# Altium schematic sheet 喷雾系统ESP32 S3.SchDoc
size A1
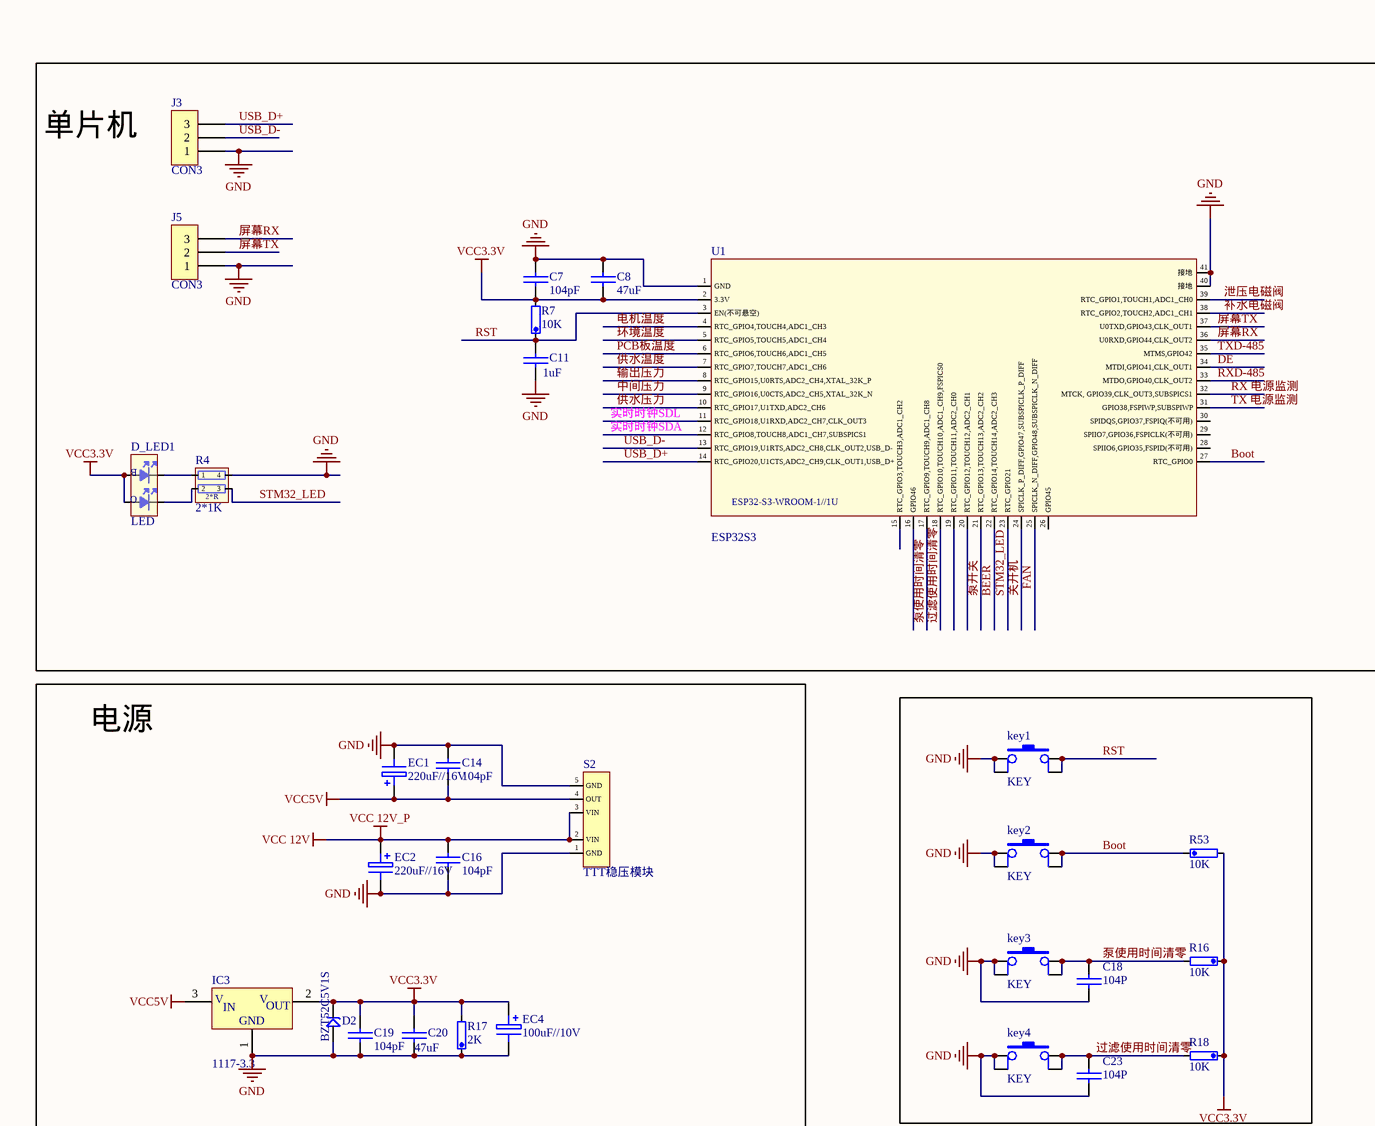
[diagram p0: 喷雾系统ESP32 S3.SchDoc, top left]
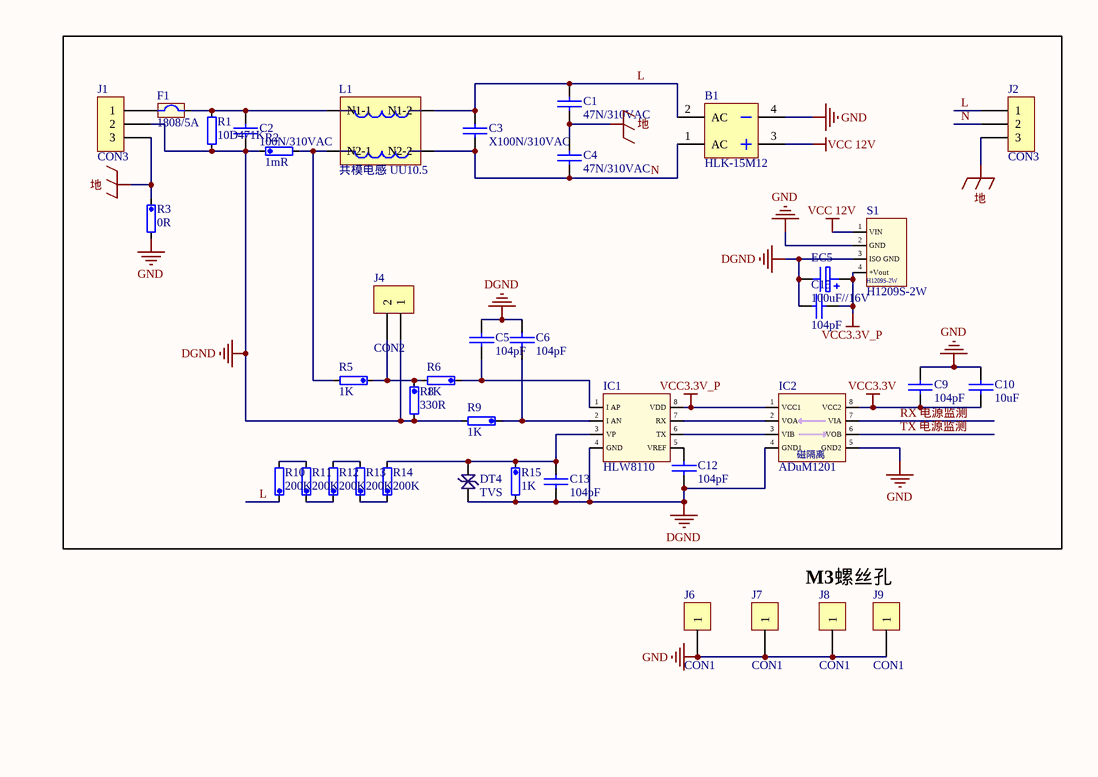
[diagram p1: 喷雾系统ESP32 S3.SchDoc, top right]
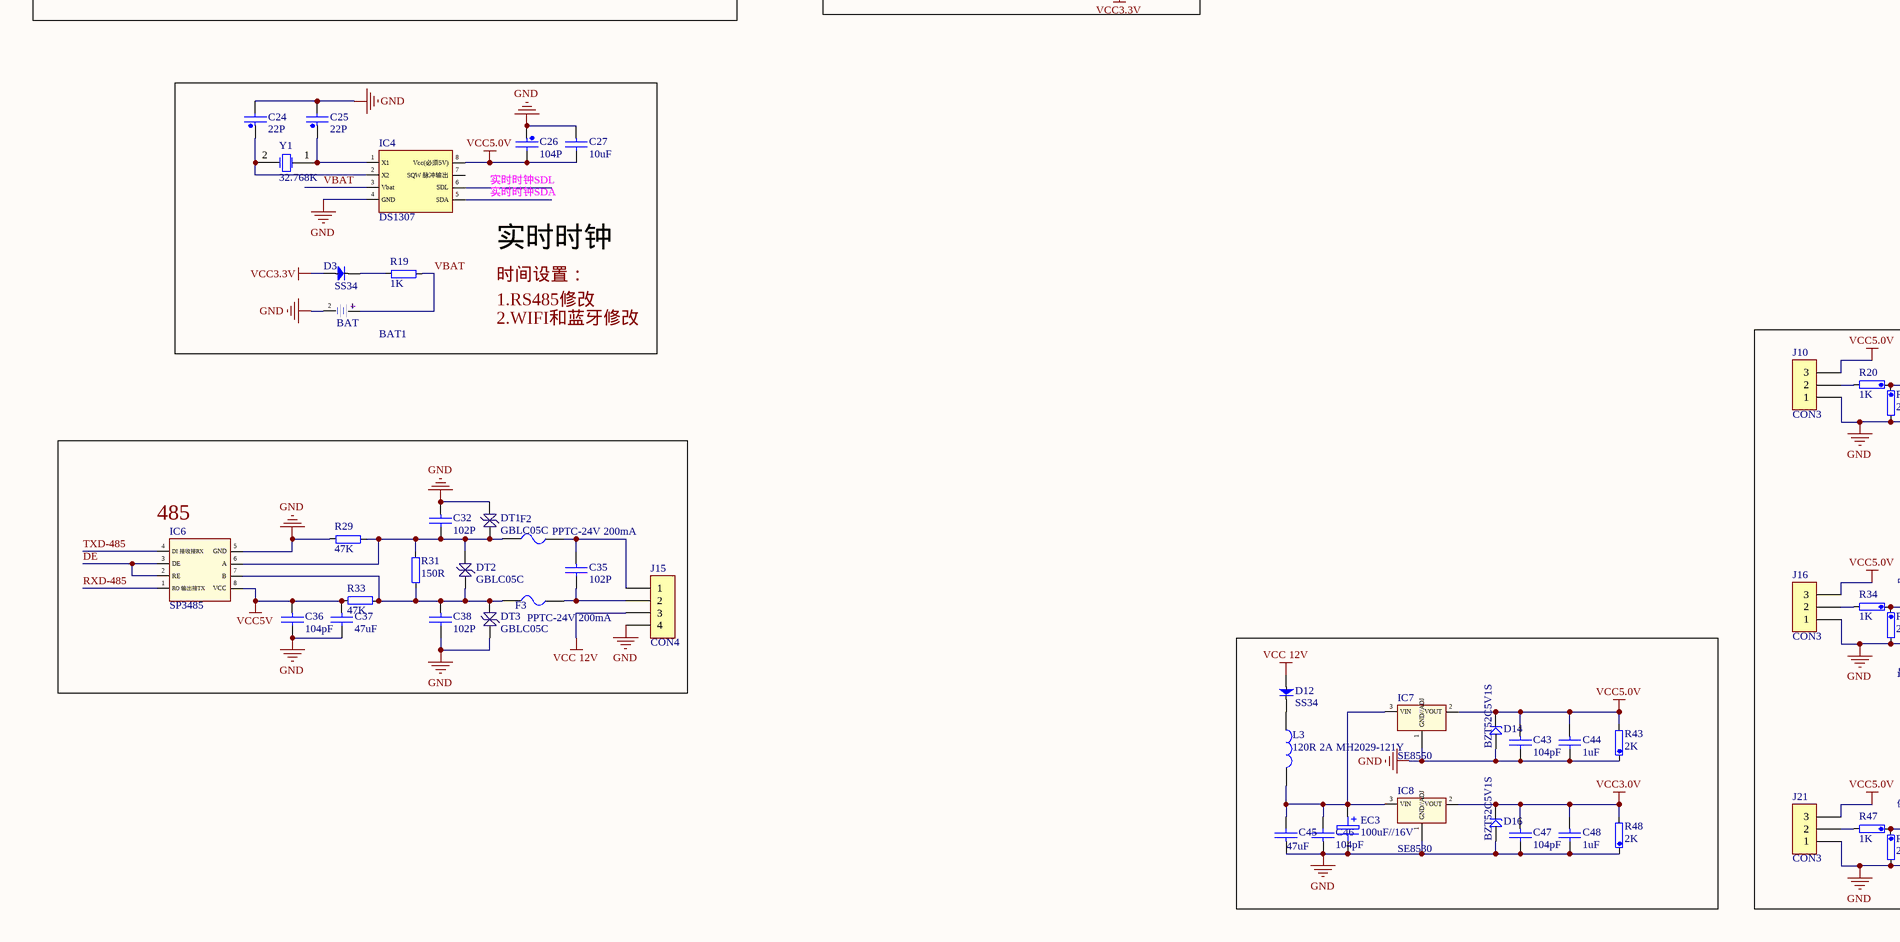
[diagram p2: 喷雾系统ESP32 S3.SchDoc, bottom left]
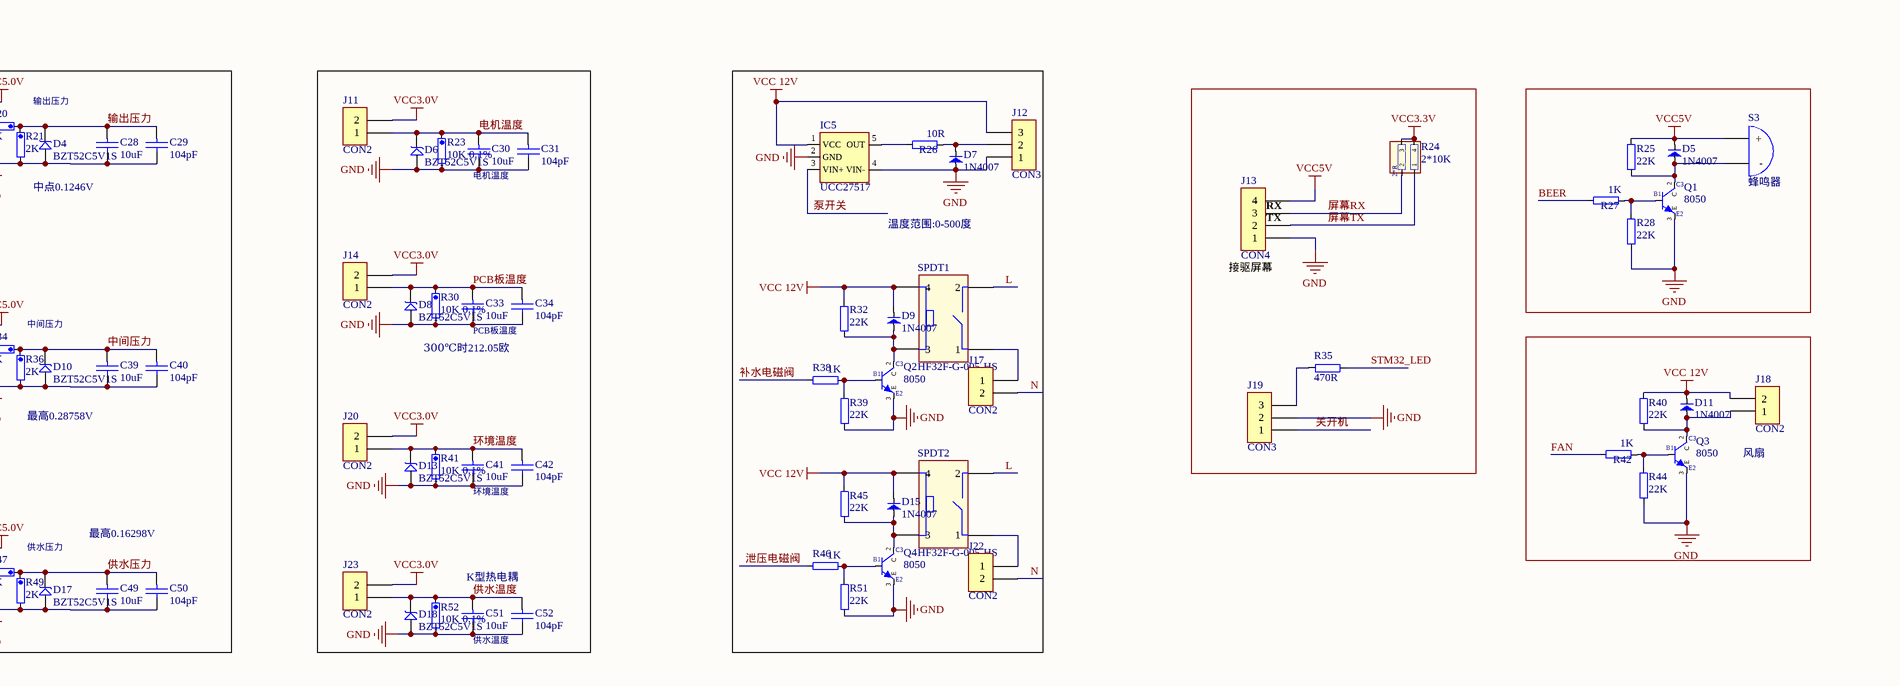
[diagram p3: 喷雾系统ESP32 S3.SchDoc, bottom right]

## Parts
B1  HLK-15M12  [电源模块15W AC转DC HI-link]
BAT1  BAT  [直插锂电池]
C1  47N/310VAC  [安规Y电容]
C2  100N/310VAC  [安规X电容]
C3  X100N/310VAC  [安规X电容]
C4  47N/310VAC  [安规Y电容]
C5  104pF  [B0805]
C6  104pF  [B0805]
C7  104pF  [B0805]
C8  47uF  [B0805]
C9  104pF  [B0805]
C10  10uF  [B0805]
C11  1uF  [B0805]
C12  104pF  [B0805]
C13  104pF  [B0805]
C14  104pF  [B0805]
C15  104pF  [B0805]
C16  104pF  [B0805]
C18  104P  [B0805]
C19  104pF  [B0805]
C20  47uF  [B0805]
C23  104P  [B0805]
C24  22P  [B0603]
C25  22P  [B0603]
C26  104P  [B0805]
C27  10uF  [B0805]
C28  10uF  [B0805]
C29  104pF  [B0805]
C30  10uF  [B0805]
C31  104pF  [B0805]
C32  102P  [B0805]
C33  10uF  [B0805]
C34  104pF  [B0805]
C35  102P  [B0805]
C36  104pF  [B0805]
C37  47uF  [B0805]
C38  102P  [B0805]
C39  10uF  [B0805]
C40  104pF  [B0805]
C41  10uF  [B0805]
C42  104pF  [B0805]
C43  104pF  [B0805]
C44  1uF  [B0805]
C45  47uF  [B0805]
C46  104pF  [B0805]
C47  104pF  [B0805]
C48  1uF  [B0805]
C49  10uF  [B0805]
C50  104pF  [B0805]
C51  10uF  [B0805]
C52  104pF  [B0805]
D2  BZT52C5V1S  [SOD-323]
D3  SS34  [SOD-323]
D4  BZT52C5V1S  [SOD-323]
D5  1N4007  [SOD-323]
D6  BZT52C5V1S  [SOD-323]
D7  1N4007  [SOD-323]
D8  BZT52C5V1S  [SOD-323]
D9  1N4007  [SOD-323]
D10  BZT52C5V1S  [SOD-323]
D11  1N4007  [SOD-323]
D12  SS34  [SOD-323]
D13  BZT52C5V1S  [SOD-323]
D14  BZT52C5V1S  [SOD-323]
D15  1N4007  [SOD-323]
D16  BZT52C5V1S  [SOD-323]
D17  BZT52C5V1S  [SOD-323]
D18  BZT52C5V1S  [SOD-323]
D_LED1  LED  [双色LED 1615]
DT1  GBLC05C  [SOD-323-12]
DT2  GBLC05C  [SOD-323-12]
DT3  GBLC05C  [SOD-323-12]
DT4  TVS  [SOD-323]
EC1  220uF//16V  [贴片电容6.3*5.4]
EC2  220uF//16V  [贴片电容6.3*5.4]
EC3  100uF//16V  [C型 电容]
EC4  100uF//10V  [C型 电容]
EC5  100uF//16V  [C型 电容]
F1  1808/5A  [1808贴片保险]
F2  PPTC-24V 200mA  [FU 0805]
F3  PPTC-24V 200mA  [FU 0805]
IC1  HLW8110  [SOP8]
IC2  ADuM1201  [SOP8]
IC3  1117-3.3  [SOT-223]
IC4  DS1307  [SOP8]
IC5  UCC27517  [SOT23-5]
IC6  SP3485  [SOP8]
IC7  SE8550  [SOT_89]
IC8  SE8530  [SOT23_231]
J1  CON3  [CON3_5.08 弯]
J2  CON3  [CON3_5.08 弯]
J3  CON3  [SIP3_2.0]
J4  CON2  [XH2.54-2P 弯]
J5  CON3  [SIP3_2.0]
J6  CON1  [螺丝孔]
J7  CON1  [螺丝孔]
J8  CON1  [螺丝孔]
J9  CON1  [螺丝孔]
J10  CON3  [XHB2.54-3]
J11  CON2  [PH2.0_2P_直针]
J12  CON3  [XHB2.54-3]
J13  CON4  [XHB2.54_4]
J14  CON2  [PH2.0_2P_直针]
J15  CON4  [XHB2.54_4]
J16  CON3  [XHB2.54-3]
J17  CON2  [CON2-5.08 弯]
J18  CON2  [XHB2.54-2]
J19  CON3  [PH2.0_3P_直针]
J20  CON2  [PH2.0_2P_直针]
J21  CON3  [XHB2.54-3]
J22  CON2  [CON2-5.08 弯]
J23  CON2  [PH2.0_2P_直针]
key1  KEY  [3*4*2.5按键]
key2  KEY  [3*4*2.5按键]
key3  KEY  [3*4*2.5按键]
key4  KEY  [3*4*2.5按键]
L1  共模电感 UU10.5  [UU10 共模电感]
L3  120R 2A MH2029-121Y  [B0805]
Q1  8050  [SOT231]
Q2  8050  [SOT231]
Q3  8050  [SOT231]
Q4  8050  [SOT231]
R1  10D471K  [10D471K]
R2  1mR  [B2410]
R3  0R  [B0805]
R4  2*1K  [B0402-2]
R5  1K  [B0603]
R6  1K  [B0603]
R7  10K  [B0603]
R8  330R  [B0805]
R9  1K  [B0603]
R10  200K  [B0603]
R11  200K  [B0603]
R12  200K  [B0603]
R13  200K  [B0603]
R14  200K  [B0603]
R15  1K  [B0805]
R16  10K  [B0603]
R17  2K  [B0603]
R18  10K  [B0603]
R19  1K  [B0603]
R20  1K  [B0603]
R21  2K  [B0603]
R23  10K 0.1%  [B0603]
R24  2*10K  [B0402-2]
R25  22K  [B0603]
R26  10R  [B0603]
R27  1K  [B0603]
R28  22K  [B0603]
R29  47K  [B0603]
R30  10K 0.1%  [B0603]
R31  150R  [B0603]
R32  22K  [B0603]
R33  47K  [B0603]
R34  1K  [B0603]
R35  470R  [B0603]
R36  2K  [B0603]
R38  1K  [B0603]
R39  22K  [B0603]
R40  22K  [B0603]
R41  10K 0.1%  [B0603]
R42  1K  [B0603]
R43  2K  [B0603]
R44  22K  [B0603]
R45  22K  [B0603]
R46  1K  [B0603]
R47  1K  [B0603]
R48  2K  [B0603]
R49  2K  [B0603]
R51  22K  [B0603]
R52  10K 0.1%  [B0603]
R53  10K  [B0603]
S1  H1209S-2W  [隔离电源 H1209S]
S2  TTT稳压模块  [TTT稳压模块]
S3  蜂鸣器  [12065蜂鸣器7.62]
SPDT1  HF32F-G-005-HS  [HF32FV]
SPDT2  HF32F-G-005-HS  [HF32FV]
U1  ESP32S3  [ESP32-S3-WROOM-1U]
Y1  32.768K  [晶振 FC135]

## Blocks framed on the sheet
单片机: C7 C8 C11 D_LED1 J3 J5 R4 R7 U1
电源: C14 C16 C19 C20 D2 EC1 EC2 EC4 IC3 R17 S2
实时时钟: BAT1 C24-C27 D3 IC4 R19 Y1
温度范围:0-500度: D7 D9 D15 IC5 J12 J17 J22 Q2 Q4 R26 R32 R38 R39 R45 R46 R51 SPDT1 SPDT2
485: C32 C35-C38 DT1-DT3 F2 F3 IC6 J15 R29 R31 R33
风扇: D11 J18 Q3 R40 R42 R44

## Nets
DGND: C2.2 C5.2 C6.2 C12.1 C13.1 C15.1 DT4.A EC5.2(E) IC1.4(GND) IC2.4(GND1) J1.2 J4.1 R1.1 R2.1 R8.2 R9.2 R15.2 S1.3(ISO_GND)
GND: B1.4(-) BAT1.2(-) C7.1 C8.1 C9.2 C10.2 C11.2 C14.1 C16.1 C18.2 C19.2 C20.1 C23.2 C24.2 C25.2 C26.1 C27.1 C28.2 C29.2 C30.2 C31.2 C32.1 C33.2 C34.2 C36.2 C37.2 C38.2 C39.2 C40.2 C41.2 C42.2 C43.2 C44.2 C45.1 C46.1 C47.2 C48.2 C49.2 C50.2 C51.2 C52.2 D2.A D4.A D6.A D7.A D8.A D10.A D13.A D14.A D16.A D17.A D18.A DT1.2 DT3.2 EC1.2(E) EC2.2(E) EC3.2(E) EC4.2(E) IC2.5(GND2) IC3.1(GND) IC4.4(GND) IC5.2(GND) IC5.4(VIN-) IC6.5(GND) IC7.1(GND//ADJ) IC8.1(GND//ADJ) J3.1 J5.1 J6.1 J7.1 J8.1 J9.1 J10.1 J12.1 J13.1 J15.4 J16.1 J19.2 J21.1 key1.1 key1.2 key2.1 key2.2 key3.1 key3.2 key4.1 key4.2 Q1.3(E) Q2.3(E) Q3.3(E) Q4.3(E) R3.2 R4.4 R17.1 R21.2 R23.2 R28.2 R29.1 R30.2 R36.2 R39.2 R41.2 R43.1 R44.2 R48.1 R49.2 R51.2 R52.2 S1.2(GND) S2.1(GND) S2.5(GND) U1.1(GND) U1.40(接地) U1.41(接地)
VCC3.0V: C47.1 C48.1 D16.K IC8.2(VOUT) J11.2 J14.2 J20.2 J23.2 R48.2
VCC3.3V: C7.2 C8.2 C9.1 C10.1 C19.1 C20.2 D2.K D3.A D_LED1.2 D_LED1.3 EC4.1 IC2.8(VCC2) IC3.2(VOUT) R7.2 R16.1 R17.2 R18.1 R24.3 R24.4 R53.2 U1.2(3.3V)
VCC3.3V_P: C15.2 EC5.1 IC1.8(VDD) IC2.1(VCC1) S1.4(+Vout)
VCC5.0V: C26.2 C27.2 C43.1 C44.1 D14.K IC4.8(Vcc(必须5V)) IC7.2(VOUT) J10.3 J16.3 J21.3 R43.2
VCC5V: C14.2 C36.1 C37.1 D5.K EC1.1 IC3.3(VIN) IC6.8(VCC) J13.4 R25.1 R33.2 S2.4(OUT) S3.1(+)
VCC 12V: B1.3(+) C16.2 D9.K D11.K D12.A D15.K EC2.1 IC5.1(VCC) J12.3 J15.3 J18.2 R32.2 R40.1 R45.1 S1.1(VIN) S2.2(VIN) S2.3(VIN) SPDT1.4 SPDT2.4  [also labelled VCC 12V_P]
地: C1.1 C4.2 J1.3 J2.3 R3.1
BEER: R27.2 U1.22(RTC_GPIO14,TOUCH14,ADC2_CH3)
Boot: key2.3 key2.4 R53.1 U1.27(RTC_GPIO0)
DE: IC6.2(RE) IC6.3(DE) U1.34(MTDI,GPIO41,CLK_OUT1)
FAN: R42.2 U1.25(SPICLK_N_DIFF,GPIO48,SUBSPICLK_N_DIFF)
L: B1.2(AC) C1.2 C3.1 J2.1 L1.2(N1-2) R10.1 SPDT1.2 SPDT2.2
N: B1.1(AC) C3.2 C4.1 J2.2 J17.2 J22.2 L1.4(N2-2)
PCB板温度: C33.1 C34.1 D8.K J14.1 R30.1 U1.6(RTC_GPIO6,TOUCH6,ADC1_CH5)
RST: C11.1 key1.3 key1.4 R7.1 U1.3(EN(不可悬空))
RX 电源监测: IC2.7(VIA) U1.32(MTCK,_GPIO39,CLK_OUT3,SUBSPICS1)
RXD-485: IC6.1(RO_输出接TX) U1.33(MTDO,GPIO40,CLK_OUT2)
STM32_LED: R4.3 R35.2 U1.23(RTC_GPIO21)
TX 电源监测: IC2.6(VOB) U1.31(GPIO38,FSPIWP,SUBSPIWP)
TXD-485: IC6.4(DI_接收接RX) U1.35(MTMS,GPIO42)
USB_D+: J3.3 U1.14(RTC_GPIO20,U1CTS,ADC2_CH9,CLK_OUT1,USB_D+)
USB_D-: J3.2 U1.13(RTC_GPIO19,U1RTS,ADC2_CH8,CLK_OUT2,USB_D-)
VBAT: BAT1.1(+) IC4.3(Vbat) R19.2
中间压力: C39.1 C40.1 D10.K R34.1 R36.1 U1.9(RTC_GPIO16,U0CTS,ADC2_CH5,XTAL_32K_N)
供水压力: C49.1 C50.1 D17.K R47.1 R49.1 U1.10(RTC_GPIO17,U1TXD,ADC2_CH6)
供水温度: C51.1 C52.1 D18.K J23.1 R52.1 U1.7(RTC_GPIO7,TOUCH7,ADC1_CH6)
关开机: J19.1 U1.24(SPICLK_P_DIFF,GPIO47,SUBSPICLK_P_DIFF)
实时时钟SDA: IC4.5(SDA) U1.12(RTC_GPIO8,TOUCH8,ADC1_CH7,SUBSPICS1)
实时时钟SDL: IC4.6(SDL) U1.11(RTC_GPIO18,U1RXD,ADC2_CH7,CLK_OUT3)
屏幕RX: J5.3 J13.3 R24.2 U1.36(U0RXD,GPIO44,CLK_OUT2)
屏幕TX: J5.2 J13.2 R24.1 U1.37(U0TXD,GPIO43,CLK_OUT1)
泄压电磁阀: R46.2 U1.39(RTC_GPIO1,TOUCH1,ADC1_CH0)
泵使用时间清零: C18.1 key3.3 key3.4 R16.2 U1.17(RTC_GPIO9,TOUCH9,ADC1_CH8)
泵开关: IC5.3(VIN+) U1.21(RTC_GPIO13,TOUCH13,ADC2_CH2)
环境温度: C41.1 C42.1 D13.K J20.1 R41.1 U1.5(RTC_GPIO5,TOUCH5,ADC1_CH4)
电机温度: C30.1 C31.1 D6.K J11.1 R23.1 U1.4(RTC_GPIO4,TOUCH4,ADC1_CH3)
补水电磁阀: R38.2 U1.38(RTC_GPIO2,TOUCH2,ADC1_CH1)
输出压力: C28.1 C29.1 D4.K R20.1 R21.1 U1.8(RTC_GPIO15,U0RTS,ADC2_CH4,XTAL_32K_P)
过滤使用时间清零: C23.1 key4.3 key4.4 R18.2 U1.18(RTC_GPIO10,TOUCH10,ADC1_CH9,FSPICS0)
NetC2_1: C2.1 F1.1 L1.1(N1-1) R1.2
NetC5_1: C5.1 IC1.1(I_AP) R6.1
NetC6_1: C6.1 IC1.2(I_AN) R9.1
NetC12_2: C12.2 IC1.5(VREF)
NetC13_2: C13.2 DT4.K IC1.3(VP) R14.2 R15.1
NetC24_1: C24.1 IC4.2(X2) Y1.2(OSC2)
NetC25_1: C25.1 IC4.1(X1) Y1.1(OSC1)
NetC32_2: C32.2 DT1.1 DT2.1 F2.2 IC6.6(A) R29.2 R31.2
NetC35_1: C35.1 F2.1 J15.1
NetC35_2: C35.2 F3.1 J15.2
NetC38_1: C38.1 DT2.2 DT3.1 F3.2 IC6.7(B) R31.1 R33.1
NetC45_2: C45.2 C46.2 EC3.1 IC7.3(VIN) IC8.3(VIN) L3.2
NetD3_K: D3.K R19.1
NetD5_A: D5.A Q1.2(C) R25.2 S3.2(－)
NetD7_K: D7.K J12.2 R26.1
NetD9_A: D9.A Q2.2(C) R32.1 SPDT1.3
NetD11_A: D11.A J18.1 Q3.2(C) R40.2
NetD12_K: D12.K L3.1
NetD15_A: D15.A Q4.2(C) R45.2 SPDT2.3
NetD_LED1_1: D_LED1.1 R4.2
NetD_LED1_4: D_LED1.4 R4.1
NetF1_2: F1.2 J1.1
NetIC1_6: IC1.6(TX) IC2.3(VIB)
NetIC1_7: IC1.7(RX) IC2.2(VOA)
NetIC5_5: IC5.5(OUT) R26.2
NetJ4_2: J4.2 R5.1 R6.2 R8.1
NetJ10_2: J10.2 R20.2
NetJ16_2: J16.2 R34.2
NetJ17_1: J17.1 SPDT1.1
NetJ19_3: J19.3 R35.1
NetJ21_2: J21.2 R47.2
NetJ22_1: J22.1 SPDT2.1
NetL1_3: L1.3(N2-1) R2.2 R5.2
NetQ1_1: Q1.1(B1) R27.1 R28.1
NetQ2_1: Q2.1(B1) R38.1 R39.1
NetQ3_1: Q3.1(B1) R42.1 R44.1
NetQ4_1: Q4.1(B1) R46.1 R51.1
NetR10_2: R10.2 R11.2
NetR11_1: R11.1 R12.1
NetR12_2: R12.2 R13.2
NetR13_1: R13.1 R14.1

Not connected (* = marked no-connect by the designer): IC4 7(SQW_脉冲输出); U1 15(RTC_GPIO3,TOUCH3,ADC1_CH2) 16(GPIO46) 19(RTC_GPIO11,TOUCH11,ADC2_CH0) 20(RTC_GPIO12,TOUCH12,ADC2_CH1) 26(GPIO45) 28(SPIIO6,GPIO35,FSPID(不可用)) 29(SPIIO7,GPIO36,FSPICLK(不可用)) 30(SPIDQS,GPIO37,FSPIQ(不可用))

## Notes on the sheet
- M3螺丝孔
- 1.RS485修改
- 时间设置：
- 2.WIFI和蓝牙修改
- 输出压力
- (near C30) 电机温度
- 中点0.1246V
- (near J13) RX
- (near J13) TX
- (near J13) 接驱屏幕
- 中间压力
- 300℃时212.05欧
- (near C33) PCB板温度
- 最高0.28758V
- 供水压力
- 最高0.16298V
- (near C41) 环境温度
- K型热电耦
- (near C51) 供水温度
- (in symbol 1117) V; IN; OUT
- (in symbol ESP32S3) ESP32-S3-WROOM-1//1U
- (in symbol NPN) C3; E2
- (in symbol 双色LED 橙蓝) B; O
- (in symbol 排阻2P) 2*R

## Library data of the parts
B1 = AC-DC模块: HI-link
BAT1 = 电池 BAT: 电池
C1 C2 C4 C14 C16 C18 C23-C27 C32 C35 C38 = CAP
C3 = CAP: 安规电容
C5-C13 C15 C19 C20 C28-C31 C33 C34 C36 C37 C39-C52 = CAP: 电容
D2 D4 D6 D8 D10 D13 D14 D16-D18 = 单向稳压二极管
D3 D5 D7 D9 D11 D12 D15 = DIODE
D_LED1 = 双色LED 橙蓝
DT1-DT3 = TVS
EC1-EC5 = EC
F1 = 保险
F2 F3 = FU: 贴片保险丝; 版权归属: 源创客; BOM名称: 贴片保险丝; 学习资源: www.ooocke.com
IC1 = HLW8110: 电能计量
IC2 = 磁隔离: 磁隔离 ADuM1201
IC3 = 1117
IC5 = 场管驱动 UCC27517: 场管驱动
IC6 = SP3485: RS485 收发
IC7 IC8 = 稳压LOD+ 2脚输出: 稳压LOD+
J1-J3 J5 J10 J12 J16 J19 J21 = CON3: Connector
J4 J11 J14 J17 J18 J20 J22 J23 = CON2: Connector
J6-J9 = CON1: Connector
J13 J15 = CON4: Connector
L3 = INDUCTOR
Q1-Q4 = NPN: NPN Transistor
R1-R3 R5-R21 R23 R25-R36 R38-R49 R51-R53 = RES
R4 R24 = 排阻2P
S1 = 隔离电源 H1209S-2W
SPDT1 SPDT2 = 继电器Relay
Y1 = XTAL: Crystal Oscillator; Published: 8-Jun-2000; LatestRevisionDate: 17-Jul-2002; LatestRevisionNote: Re-released for DXP Platform.; Publisher: Altium Limited